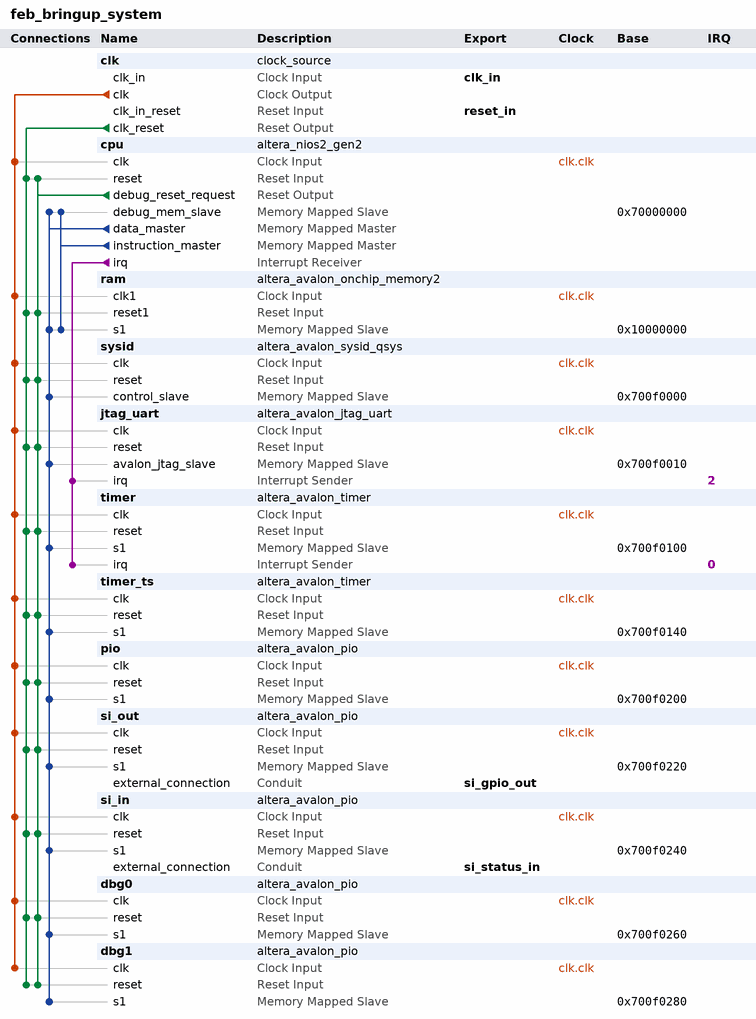
[diagram p0: system contents]
# Platform Designer (Qsys) system feb_bringup_system, Arria V 5AGXBA7D4F31C5
# Parameters at their usual value, and those the tool derives, are not listed.
package require -exact qsys 18.1
create_system feb_bringup_system
set_project_property DEVICE_FAMILY {Arria V}
set_project_property DEVICE 5AGXBA7D4F31C5

add_instance clk clock_source 18.1
set_instance_parameter_value clk clockFrequency 50000000
set_instance_parameter_value clk resetSynchronousEdges DEASSERT

add_instance cpu altera_nios2_gen2 18.1
set_instance_parameter_value cpu dcache_size 2048
set_instance_parameter_value cpu exceptionSlave ram.s1
set_instance_parameter_value cpu icache_size 4096
set_instance_parameter_value cpu impl Tiny
set_instance_parameter_value cpu io_regionbase 1879048192
set_instance_parameter_value cpu io_regionsize 268435456
set_instance_parameter_value cpu resetSlave ram.s1

add_instance ram altera_avalon_onchip_memory2 18.1
set_instance_parameter_value ram dataWidth 32
set_instance_parameter_value ram dualPort false
set_instance_parameter_value ram initMemContent true
set_instance_parameter_value ram initializationFileName /home/yifeng/packages/mu3e_ip_dev/mu3e-ip-cores/firmware_builds/systems/system_20260427_testplanphase5/syn/board_projects/fe_scifi_feb_v3/generated/software/app/mem_init/nios_ram.hex
set_instance_parameter_value ram memorySize 65536
set_instance_parameter_value ram useNonDefaultInitFile true

add_instance sysid altera_avalon_sysid_qsys 18.1
set_instance_parameter_value sysid id 1178944051

add_instance jtag_uart altera_avalon_jtag_uart 18.1
set_instance_parameter_value jtag_uart simInteractiveOptions NO_INTERACTIVE_WINDOWS

add_instance timer altera_avalon_timer 18.1
set_instance_parameter_value timer alwaysRun true
set_instance_parameter_value timer fixedPeriod true
set_instance_parameter_value timer period 1
set_instance_parameter_value timer periodUnits MSEC
set_instance_parameter_value timer snapshot false

add_instance timer_ts altera_avalon_timer 18.1
set_instance_parameter_value timer_ts period 1
set_instance_parameter_value timer_ts periodUnits MSEC

add_instance pio altera_avalon_pio 18.1
set_instance_parameter_value pio bitModifyingOutReg true
set_instance_parameter_value pio direction Output
set_instance_parameter_value pio width 32

add_instance si_out altera_avalon_pio 18.1
set_instance_parameter_value si_out bitModifyingOutReg true
set_instance_parameter_value si_out direction Output
set_instance_parameter_value si_out resetValue 60
set_instance_parameter_value si_out width 16

add_instance si_in altera_avalon_pio 18.1
set_instance_parameter_value si_in direction Input
set_instance_parameter_value si_in width 8

add_instance dbg0 altera_avalon_pio 18.1
set_instance_parameter_value dbg0 bitModifyingOutReg true
set_instance_parameter_value dbg0 direction Output
set_instance_parameter_value dbg0 width 32

add_instance dbg1 altera_avalon_pio 18.1
set_instance_parameter_value dbg1 bitModifyingOutReg true
set_instance_parameter_value dbg1 direction Output
set_instance_parameter_value dbg1 width 32

# connections
add_connection clk.clk cpu.clk clock
add_connection clk.clk dbg0.clk clock
add_connection clk.clk dbg1.clk clock
add_connection clk.clk jtag_uart.clk clock
add_connection clk.clk pio.clk clock
add_connection clk.clk ram.clk1 clock
add_connection clk.clk si_in.clk clock
add_connection clk.clk si_out.clk clock
add_connection clk.clk sysid.clk clock
add_connection clk.clk timer.clk clock
add_connection clk.clk timer_ts.clk clock
add_connection clk.clk_reset cpu.reset reset
add_connection clk.clk_reset dbg0.reset reset
add_connection clk.clk_reset dbg1.reset reset
add_connection clk.clk_reset jtag_uart.reset reset
add_connection clk.clk_reset pio.reset reset
add_connection clk.clk_reset ram.reset1 reset
add_connection clk.clk_reset si_in.reset reset
add_connection clk.clk_reset si_out.reset reset
add_connection clk.clk_reset sysid.reset reset
add_connection clk.clk_reset timer.reset reset
add_connection clk.clk_reset timer_ts.reset reset
add_connection cpu.debug_reset_request cpu.reset reset
add_connection cpu.debug_reset_request dbg0.reset reset
add_connection cpu.debug_reset_request dbg1.reset reset
add_connection cpu.debug_reset_request jtag_uart.reset reset
add_connection cpu.debug_reset_request pio.reset reset
add_connection cpu.debug_reset_request ram.reset1 reset
add_connection cpu.debug_reset_request si_in.reset reset
add_connection cpu.debug_reset_request si_out.reset reset
add_connection cpu.debug_reset_request sysid.reset reset
add_connection cpu.debug_reset_request timer.reset reset
add_connection cpu.debug_reset_request timer_ts.reset reset
add_connection cpu.data_master cpu.debug_mem_slave avalon
set_connection_parameter_value cpu.data_master/cpu.debug_mem_slave baseAddress 0x70000000
add_connection cpu.data_master dbg0.s1 avalon
set_connection_parameter_value cpu.data_master/dbg0.s1 baseAddress 0x700f0260
add_connection cpu.data_master dbg1.s1 avalon
set_connection_parameter_value cpu.data_master/dbg1.s1 baseAddress 0x700f0280
add_connection cpu.data_master jtag_uart.avalon_jtag_slave avalon
set_connection_parameter_value cpu.data_master/jtag_uart.avalon_jtag_slave baseAddress 0x700f0010
add_connection cpu.data_master pio.s1 avalon
set_connection_parameter_value cpu.data_master/pio.s1 baseAddress 0x700f0200
add_connection cpu.data_master ram.s1 avalon
set_connection_parameter_value cpu.data_master/ram.s1 baseAddress 0x10000000
add_connection cpu.data_master si_in.s1 avalon
set_connection_parameter_value cpu.data_master/si_in.s1 baseAddress 0x700f0240
add_connection cpu.data_master si_out.s1 avalon
set_connection_parameter_value cpu.data_master/si_out.s1 baseAddress 0x700f0220
add_connection cpu.data_master sysid.control_slave avalon
set_connection_parameter_value cpu.data_master/sysid.control_slave baseAddress 0x700f0000
add_connection cpu.data_master timer.s1 avalon
set_connection_parameter_value cpu.data_master/timer.s1 baseAddress 0x700f0100
add_connection cpu.data_master timer_ts.s1 avalon
set_connection_parameter_value cpu.data_master/timer_ts.s1 baseAddress 0x700f0140
add_connection cpu.instruction_master cpu.debug_mem_slave avalon
set_connection_parameter_value cpu.instruction_master/cpu.debug_mem_slave baseAddress 0x70000000
add_connection cpu.instruction_master ram.s1 avalon
set_connection_parameter_value cpu.instruction_master/ram.s1 baseAddress 0x10000000
add_connection cpu.irq jtag_uart.irq interrupt
set_connection_parameter_value cpu.irq/jtag_uart.irq irqNumber 2
add_connection cpu.irq timer.irq interrupt
set_connection_parameter_value cpu.irq/timer.irq irqNumber 0

# exported interfaces
add_interface clk_in clock sink
set_interface_property clk_in EXPORT_OF clk.clk_in
add_interface reset_in reset sink
set_interface_property reset_in EXPORT_OF clk.clk_in_reset
add_interface si_gpio_out conduit end
set_interface_property si_gpio_out EXPORT_OF si_out.external_connection
add_interface si_status_in conduit end
set_interface_property si_status_in EXPORT_OF si_in.external_connection

set_interconnect_requirement {$system} qsys_mm.clockCrossingAdapter HANDSHAKE
set_interconnect_requirement {$system} qsys_mm.enableEccProtection FALSE
set_interconnect_requirement {$system} qsys_mm.insertDefaultSlave FALSE
set_interconnect_requirement {$system} qsys_mm.maxAdditionalLatency 1

save_system feb_bringup_system.qsys
